# EAGLE design solar-counter-v1.0 (EAGLE 6.2)

## Sheet 1 of 2
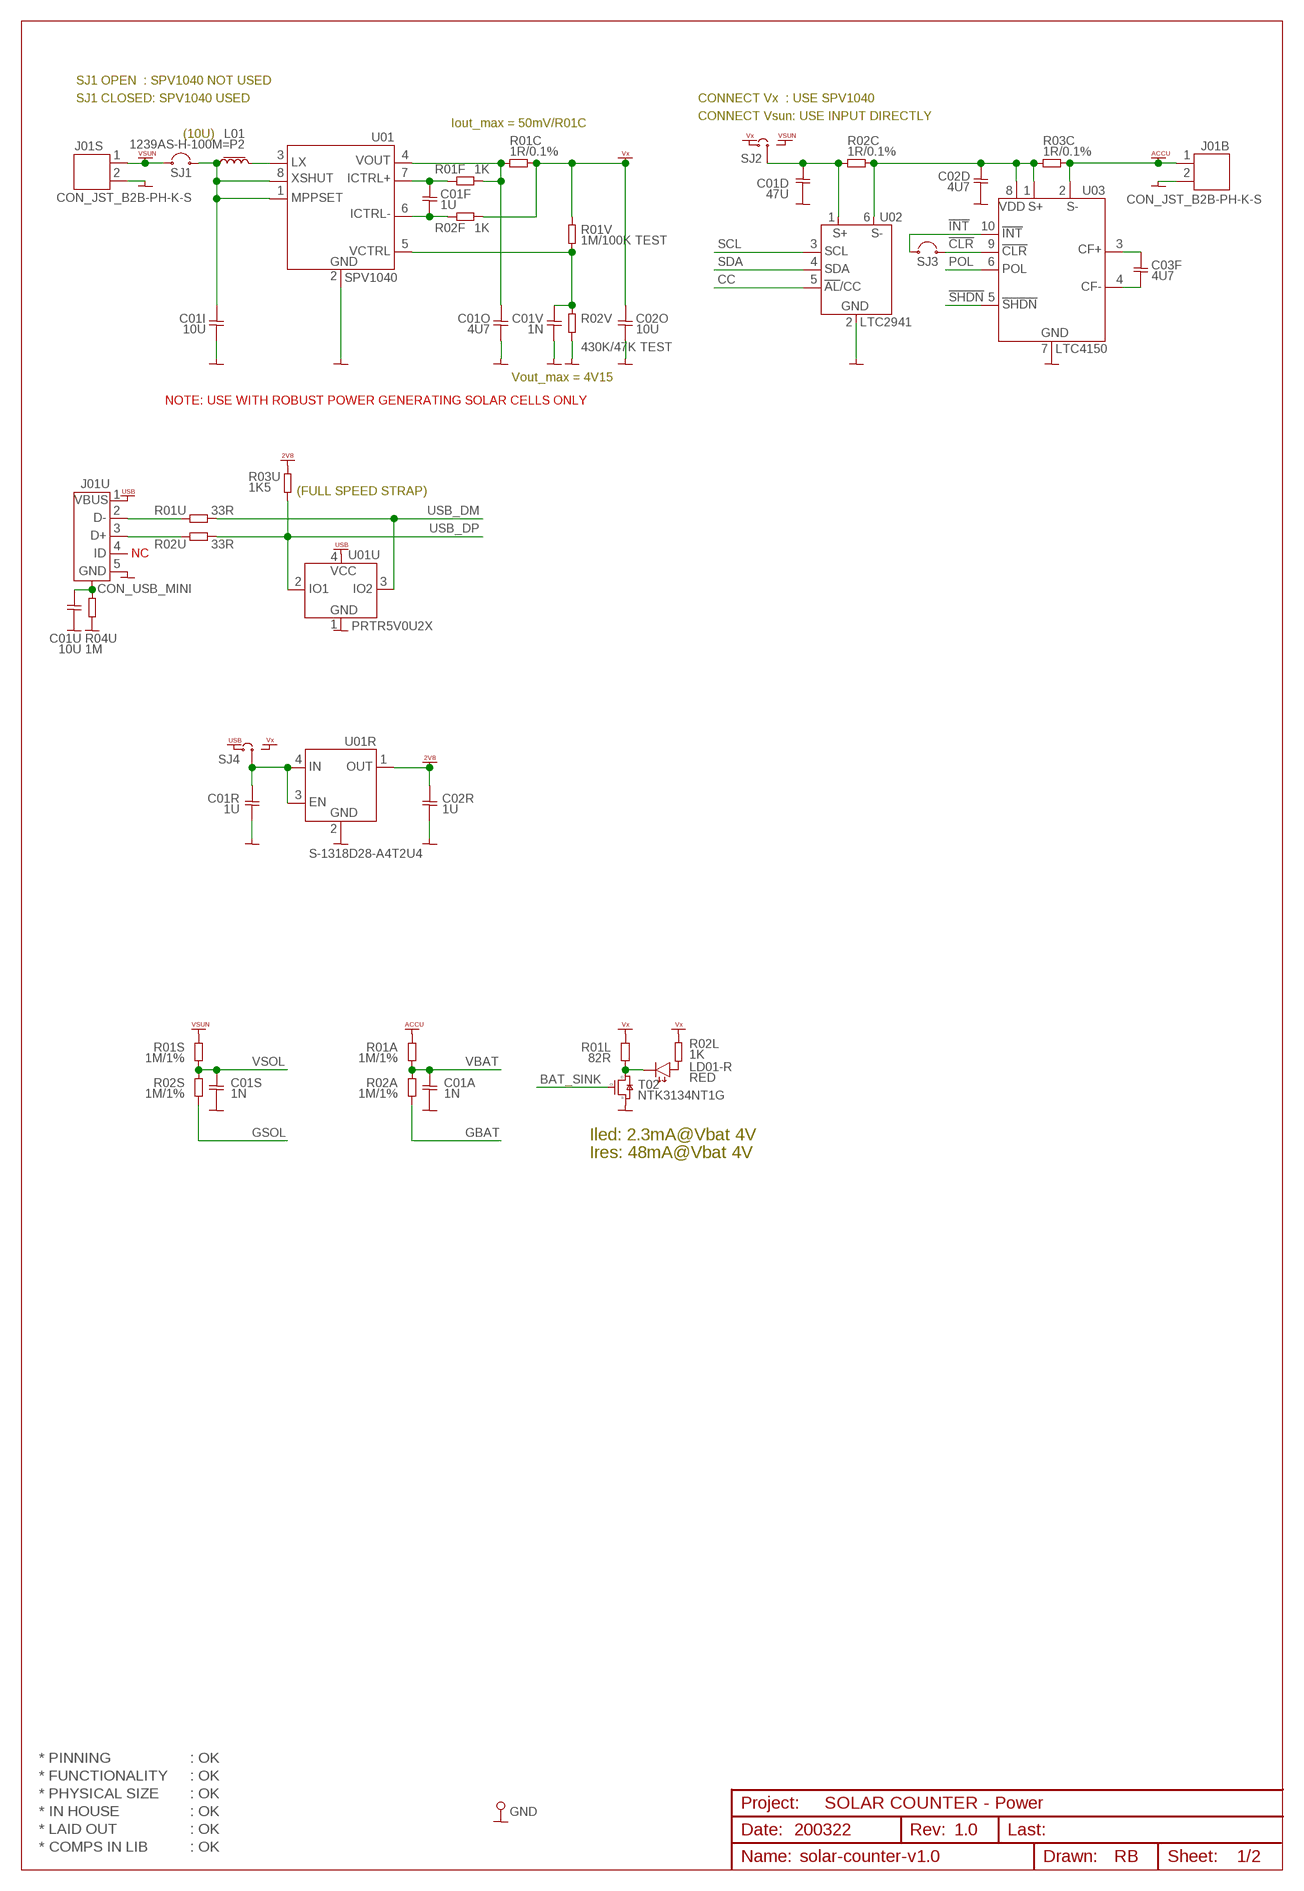
[diagram p0: schematic, sheet 1]

### Parts
C01A  1N  CAP0402  [CAP0402]
C01D  47U  CAP0603  [CAP0603]
C01F  1U  CAP0402  [CAP0402]
C01I  10U  CAP0603  [CAP0603]
C01O  4U7  CAP0402  [CAP0402]
C01R  1U  CAP0402  [CAP0402]
C01S  1N  CAP0402  [CAP0402]
C01U  10U  CAP0603  [CAP0603]
C01V  1N  CAP0402  [CAP0402]
C02D  4U7  CAP0402  [CAP0402]
C02O  10U  CAP0402  [CAP0402]
C02R  1U  CAP0402  [CAP0402]
C03F  4U7  CAP0402  [CAP0402]
GND  PIN_TEST  [HOLE_PTH_0.8MM]
J01B  CON_JST_B2B-PH-K-S  [CON_JST_B2B-PH-K-S]
J01S  CON_JST_B2B-PH-K-S  [CON_JST_B2B-PH-K-S]
J01U  CON_USB_MINI  [CON_USB-B_MINI]
L01  1239AS-H-100M=P2  L_1008  [L_1008]
LD01-R  RED  LED_SMD_0402  [LED_SMD_0402]
R01A  1M/1%  RES0402  [RES0402]
R01C  1R/0.1%  RES0402  [RES0402]
R01F  1K  RES0402  [RES0402]
R01L  82R  RES0402  [RES0402]
R01S  1M/1%  RES0402  [RES0402]
R01U  33R  RES0402  [RES0402]
R01V  1M/100K TEST  RES0402  [RES0402]
R02A  1M/1%  RES0402  [RES0402]
R02C  1R/0.1%  RES0402  [RES0402]
R02F  1K  RES0402  [RES0402]
R02L  1K  RES0402  [RES0402]
R02S  1M/1%  RES0402  [RES0402]
R02U  33R  RES0402  [RES0402]
R02V  430K/47K TEST  RES0402  [RES0402]
R03C  1R/0.1%  RES0402  [RES0402]
R03U  1K5  RES0402  [RES0402]
R04U  1M  RES0603  [RES0603]
SJ1  SJ2SJ2-S  [SJ2-S]
SJ2  SJ3SJ3-S  [SJ3-S]
SJ3  SJ2SJ2-S  [SJ2-S]
SJ4  SJ3SJ3-S  [SJ3-S]
T02  NTK3134NT1G  NFET_SOT723  [NFET_SOT723]
U01  SPV1040  [TSSOP8]
U01R  S-1318D28-A4T2U4  [HSNT-4-B]
U01U  PRTR5V0U2X  [SOT143B]
U02  LTC2941  [DFN6_2X3MM_NO-EXPOSED]
U03  LTC4150  [MSOP10]

### Nets
!CLR: SJ3.2 U03.9(9.!CLR) ; also sheet 2
!INT: SJ3.1 U03.10(10.!INT) ; also sheet 2
!SHDN: U03.5(5.!SHDN) ; also sheet 2
ACCU: J01B.1 R01A.2 R03C.2 U03.2(2.SENSE-) ; supply symbol labelled VACCU
BAT_SINK: T02.1(1.G) ; also sheet 2
CC: U02.5(5.AL/CC) ; also sheet 2
GBAT: R02A.1 ; also sheet 2
GND: C01A.2 C01D.2 C01I.2 C01O.2 C01R.2 C01S.2 C01U.2 C01V.2 C02D.2 C02O.2 C02R.2 GND.1 J01B.2 J01S.2 J01U.5(5.GND) R02V.2 R04U.2 T02.2(2.S) U01.2(2.GND) U01R.2(2.GND) U01R.5(2.GND) U01U.1(1.GND) U02.2(2.GND) U03.7(7.GND) ; also sheet 2
GSOL: R02S.1 ; also sheet 2
N$1: C01D.1 R02C.1 SJ2.2 U02.1(1.SENSE+)
N$2: LD01-R.A R02L.2
N$3: C01F.2 R02F.2 U01.6(6.ICTRL-)
N$4: C02D.1 R02C.2 R03C.1 U02.6(6.SENSE-) U03.1(1.SENSE+) U03.8(8.VDD)
N$6: C01I.1 L01.2 SJ1.2 U01.1(1.MPPSET) U01.8(8.XSHUT)
N$8: LD01-R.C R01L.1 T02.3(3.D)
N$9: C01F.1 R01F.2 U01.7(7.ICTRL+)
N$10: L01.1 U01.3(3.LX)
N$12: C03F.2 U03.4(4.CF-)
N$13: C03F.1 U03.3(3.CF+)
N$16: J01U.2(2.D-) R01U.1
N$18: J01U.3(3.D+) R02U.1
POL: U03.6(6.POL) ; also sheet 2
SCL: U02.3(3.SCL) ; also sheet 2
SDA: U02.4(4.SDA) ; also sheet 2
USB_CHASSIS: C01U.1 J01U.CASE1(CASE) J01U.CASE2(CASE) J01U.CASE3(CASE) J01U.CASE4(CASE) R04U.1
USB_DM: R01U.2 U01U.3(3.IO2) ; also sheet 2
USB_DP: R02U.2 R03U.1 U01U.2(2.IO1) ; also sheet 2
VBAT: C01A.1 R01A.1 R02A.2 ; also sheet 2
VDD_2V8: C02R.1 R03U.2 U01R.1(1.OUT) ; supply symbol labelled VCC_2V8 ; also sheet 2
VDD_USB: J01U.1(1.VBUS) SJ4.1 U01U.4(4.VCC) ; supply symbol labelled VCC_POWER-USB
VIN: C01R.1 SJ4.2 U01R.3(3.EN) U01R.4(4.IN)
VOUT: C01O.1 R01C.1 R01F.1 U01.4(4.VOUT)
VOUT_SET: C01V.1 R01V.2 R02V.1 U01.5(5.VCTRL)
VSOL: C01S.1 R01S.1 R02S.2 ; also sheet 2
VSUN: J01S.1 R01S.2 SJ1.1 SJ2.3
VX: C02O.1 R01C.2 R01L.2 R01V.1 R02F.1 R02L.1 SJ2.1 SJ4.3
Unconnected: J01U.4(4.ID)

### Notes on the sheet
- SJ1 OPEN  : SPV1040 NOT USED
- SJ1 CLOSED: SPV1040 USED | CONNECT Vx  : USE SPV1040
- CONNECT Vsun: USE INPUT DIRECTLY
- Iout_max = 50mV/R01C
- (10U)
- Vout_max = 4V15
- NOTE: USE WITH ROBUST POWER GENERATING SOLAR CELLS ONLY
- (FULL SPEED STRAP)
- NC
- Iled: 2.3mA@Vbat 4V
- Ires: 48mA@Vbat 4V
- * PINNING | : OK
- * FUNCTIONALITY | : OK
- * PHYSICAL SIZE | : OK
- SOLAR COUNTER - Power
- * IN HOUSE | : OK
- * LAID OUT | : OK | 200322 | 1.0
- * COMPS IN LIB | : OK

## Sheet 2 of 2
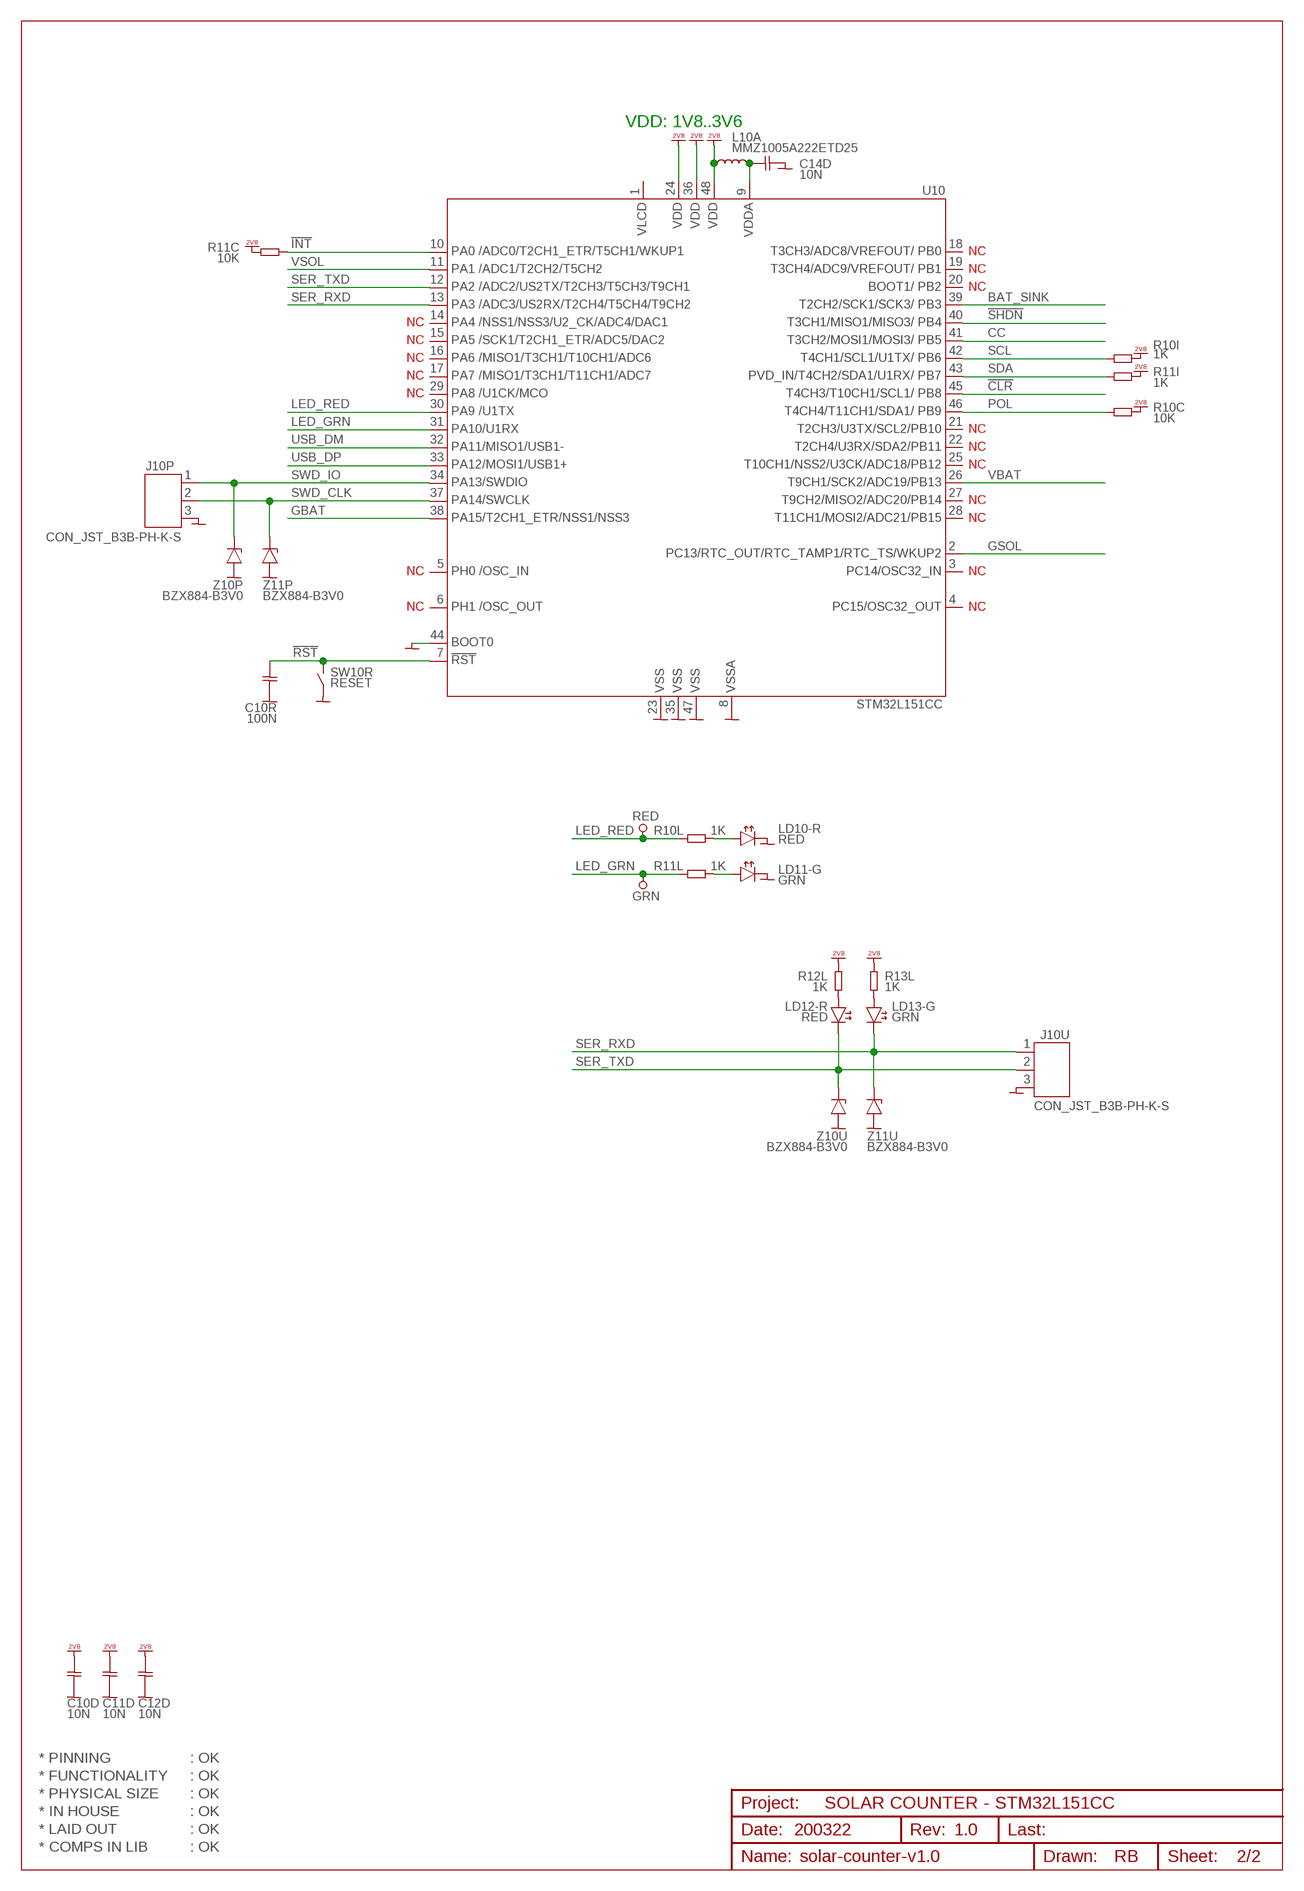
[diagram p1: schematic, sheet 2]

### Parts
C10D  10N  CAP0402  [CAP0402]
C10R  100N  CAP0402  [CAP0402]
C11D  10N  CAP0402  [CAP0402]
C12D  10N  CAP0402  [CAP0402]
C14D  10N  CAP0402  [CAP0402]
GRN  PIN_TEST_0.6MM  [HOLE_PTH_0.6MM]
J10P  CON_JST_B3B-PH-K-S  [CON_JST_B3B-PH-K-S]
J10U  CON_JST_B3B-PH-K-S  [CON_JST_B3B-PH-K-S]
L10A  MMZ1005A222ETD25  L_0402  [L_0402]
LD10-R  RED  LED_SMD_0402  [LED_SMD_0402]
LD11-G  GRN  LED_SMD_0402  [LED_SMD_0402]
LD12-R  RED  LED_SMD_0402  [LED_SMD_0402]
LD13-G  GRN  LED_SMD_0402  [LED_SMD_0402]
R10C  10K  RES0402  [RES0402]
R10I  1K  RES0402  [RES0402]
R10L  1K  RES0402  [RES0402]
R11C  10K  RES0402  [RES0402]
R11I  1K  RES0402  [RES0402]
R11L  1K  RES0402  [RES0402]
R12L  1K  RES0402  [RES0402]
R13L  1K  RES0402  [RES0402]
RED  PIN_TEST_0.6MM  [HOLE_PTH_0.6MM]
SW10R  RESET  SWITCH_PUSHBUTTON  [SWITCH_SMD_PBUTTON_2P]
U10  STM32L151CC  [LQFP48]
Z10P  BZX884-B3V0  ZENER_SOD923  [ZENER_SOD923]
Z10U  BZX884-B3V0  ZENER_SOD923  [ZENER_SOD923]
Z11P  BZX884-B3V0  ZENER_SOD923  [ZENER_SOD923]
Z11U  BZX884-B3V0  ZENER_SOD923  [ZENER_SOD923]

### Nets
!CLR: U10.45(45.PB8) ; also sheet 1
!INT: R11C.1 U10.10(10.PA0) ; also sheet 1
!RST: C10R.1 SW10R.1(1-2) U10.7(7.!RST)
!SHDN: U10.40(40.PB4) ; also sheet 1
BAT_SINK: U10.39(39.PB3) ; also sheet 1
CC: U10.41(41.PB5) ; also sheet 1
GBAT: U10.38(38.PA15) ; also sheet 1
GND: C10D.2 C10R.2 C11D.2 C12D.2 C14D.2 J10P.3 J10U.3 LD10-R.C LD11-G.C SW10R.2(3-4) U10.8(8.GND) U10.23(23.GND) U10.35(35.GND) U10.44(44.BOOT0) U10.47(47.GND) Z10P.2(A) Z10U.2(A) Z11P.2(A) Z11U.2(A) ; also sheet 1
GSOL: U10.2(2.PC13) ; also sheet 1
LED_GRN: GRN.1 R11L.1 U10.31(31.PA10)
LED_RED: R10L.1 RED.1 U10.30(30.PA9)
N$5: LD13-G.A R13L.2
N$7: LD12-R.A R12L.2
N$38: LD11-G.A R11L.2
N$39: LD10-R.A R10L.2
POL: R10C.1 U10.46(46.PB9) ; also sheet 1
SCL: R10I.1 U10.42(42.PB6) ; also sheet 1
SDA: R11I.1 U10.43(43.PB7) ; also sheet 1
SER_RXD: J10U.1 LD13-G.C U10.13(13.PA3) Z11U.1(C)
SER_TXD: J10U.2 LD12-R.C U10.12(12.PA2) Z10U.1(C)
SWD_CLK: J10P.2 U10.37(37.PA14) Z11P.1(C)
SWD_IO: J10P.1 U10.34(34.PA13) Z10P.1(C)
USB_DM: U10.32(32.PA11) ; also sheet 1
USB_DP: U10.33(33.PA12) ; also sheet 1
VBAT: U10.26(26.PB13) ; also sheet 1
VDD_2V8: C10D.1 C11D.1 C12D.1 L10A.1 R10C.2 R10I.2 R11C.2 R11I.2 R12L.1 R13L.1 U10.24(24.VDD) U10.36(36.VDD) U10.48(48.VDD) ; supply symbol labelled VCC_2V8 ; also sheet 1
VDDA: C14D.1 L10A.2 U10.9(9.VDD)
VSOL: U10.11(11.PA1) ; also sheet 1
Unconnected: U10.1(1.VDD) U10.3(3.PC14) U10.4(4.PC15) U10.5(5.OSC_IN) U10.6(6.OSC_OUT) U10.14(14.PA4) U10.15(15.PA5) U10.16(16.PA6) U10.17(17.PA7) U10.18(18.PB0) U10.19(19.PB1) U10.20(20.PB2) U10.21(21.PB10) U10.22(22.PB11) U10.25(25.PB12) U10.27(27.PB14) U10.28(28.PB15) U10.29(29.PA8)

### Notes on the sheet
- VDD: 1V8..3V6
- NC
- NC
- NC
- NC
- NC
- NC
- NC
- NC
- NC
- NC
- NC
- NC
- NC
- NC | NC
- NC | NC
- * PINNING | : OK
- * FUNCTIONALITY | : OK
- * PHYSICAL SIZE | : OK
- SOLAR COUNTER - STM32L151CC
- * IN HOUSE | : OK
- * LAID OUT | : OK | 200322 | 1.0
- * COMPS IN LIB | : OK

## Library data of the parts
C01A C01F C01O C01R C01S C01V C02D C02O C02R C03F C10D C10R C11D C12D C14D = 00-own_parts:CAP0402: Capacitor, ceramic, 0402
C01D C01I C01U = 00-own_parts:CAP0603: Capacitor, ceramic, 0603
GND = 00-own_parts:PIN_TEST: Pin, test pad, hole 0.8mm, pad 1.6mm
GRN RED = 00-own_parts:PIN_TEST_0.6MM: Pin, test pad, hole 0.6mm, pad 1.0mm
J01B J01S = 00-own_parts:CON_JST_B2B-PH-K-S: Connector, JST, 2.0mm pitch, 2p, top entry
J01U = 00-own_parts:CON_USB_MINI: Connector, USB B mini, 2.0 OTG, SMT, F#231-3554
J10P J10U = 00-own_parts:CON_JST_B3B-PH-K-S: Connector, JST, 2.0mm pitch, 3p, top entry
L01 = 00-own_parts:L_1008: Inductor, 1008 (2520 metric), chip ferrite bead/wirewound
L10A = 00-own_parts:L_0402: Inductor, 0402
LD01-R LD10-R LD11-G LD12-R LD13-G = 00-own_parts:LED_SMD_0402: LED, SMD, 0402 (PICOLED)
R01A R01C R01F R01L R01S R01U R01V R02A R02C R02F R02L R02S R02U R02V R03C R03U R04U R10C R10I R10L R11C R11I R11L R12L R13L = 00-own_parts:RES
SJ1 SJ3 = 00-own_parts:SJ2: Solder jumper, SMD, 2 way
SJ2 SJ4 = 00-own_parts:SJ3: Solder jumper, SMD, 3 way
SW10R = 00-own_parts:SWITCH_PUSHBUTTON: Switch, push button, SPNO, MCTAEF, F# 160-5485
T02 = 00-own_parts:NFET_SOT723: n-FET, generic SOT723
U01 = 00-own_parts:SPV1040: DC/DC converter, solar battery charger with embedded MPPT, TSSOP8
U01R = 00-own_parts:S-1318D28-A4T2U4: Regulator, LDO w. enable, Vin=1V7..5V5, Vout=2V8, Vdrop=45mV, Iout=100mA, Iss=95nA, HSNT-4-8
U01U = 00-own_parts:PRTR5V0U2X: Zener, ESD protection, USB data + power, SOT143B, DK#568-4140-2-ND
U02 = 00-own_parts:LTC2941: Current sense amplifier, battery gas gauge, I2C, DFN6
U03 = 00-own_parts:LTC4150: Current sense amplifier, battery gas gauge, MSOP10
U10 = 00-own_parts:STM32L151CC: MCU, ultra-low power, ARM Cortex M3, 32-bit, 32 MHz, 256 kB Flash, 32 kB SRAM, 8 kB EEPROM, USB, ADC, DAC, LQFP48
Z10P Z10U Z11P Z11U = 00-own_parts:ZENER_SOD923: Zener, generic SOD923

## Board
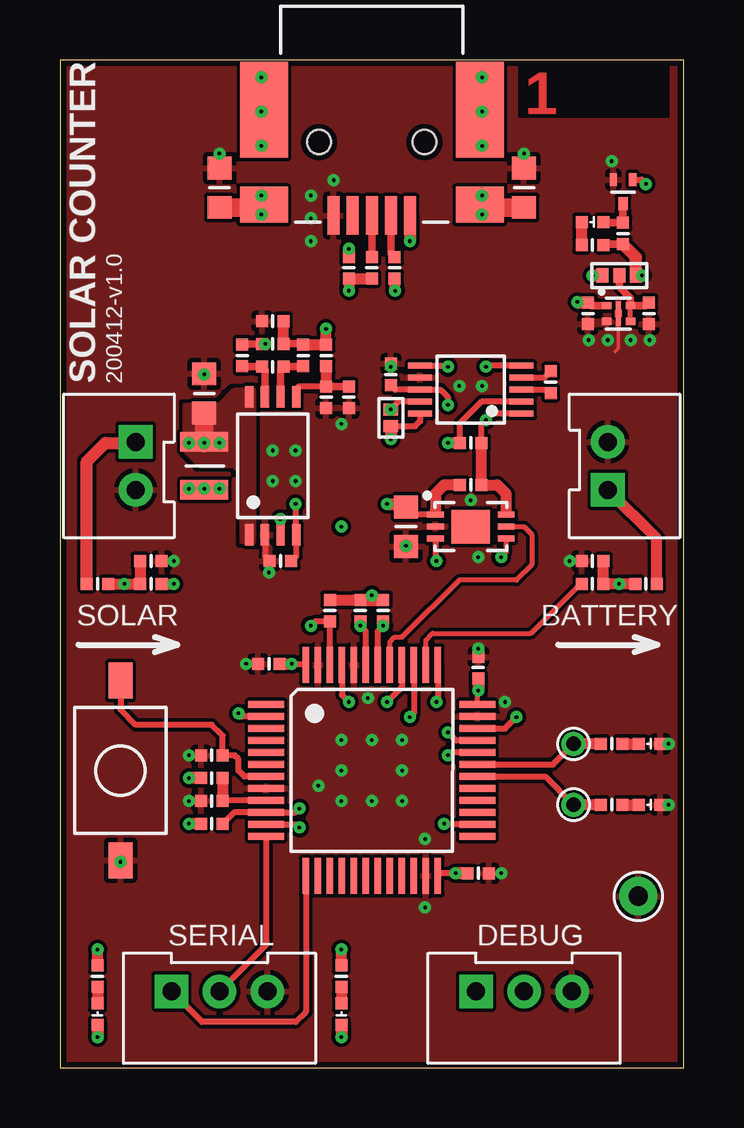
[diagram p2: board, top side]
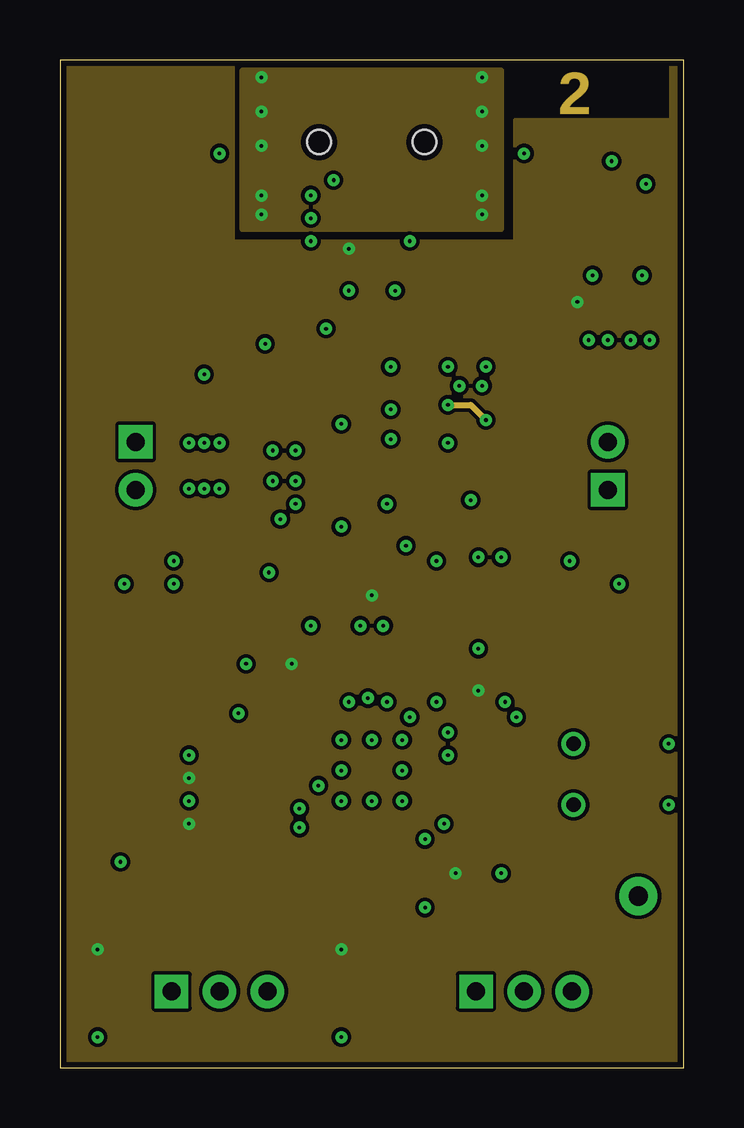
[diagram p3: board, inner layer Route2]
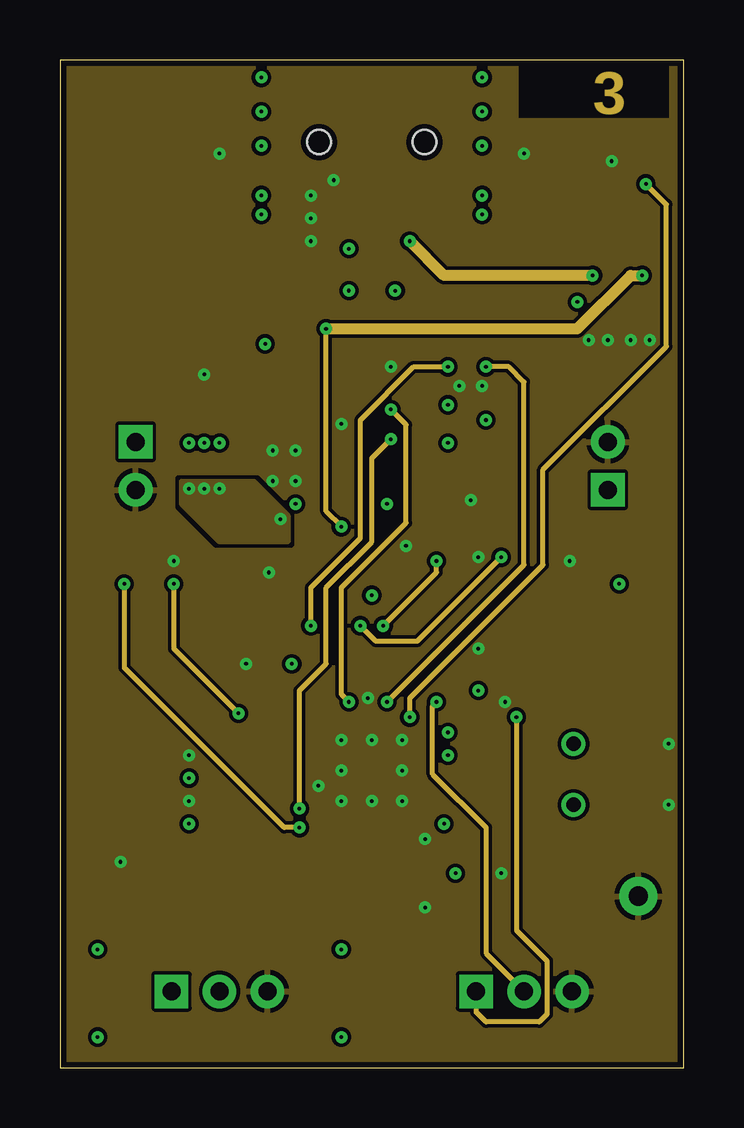
[diagram p4: board, inner layer Route15]
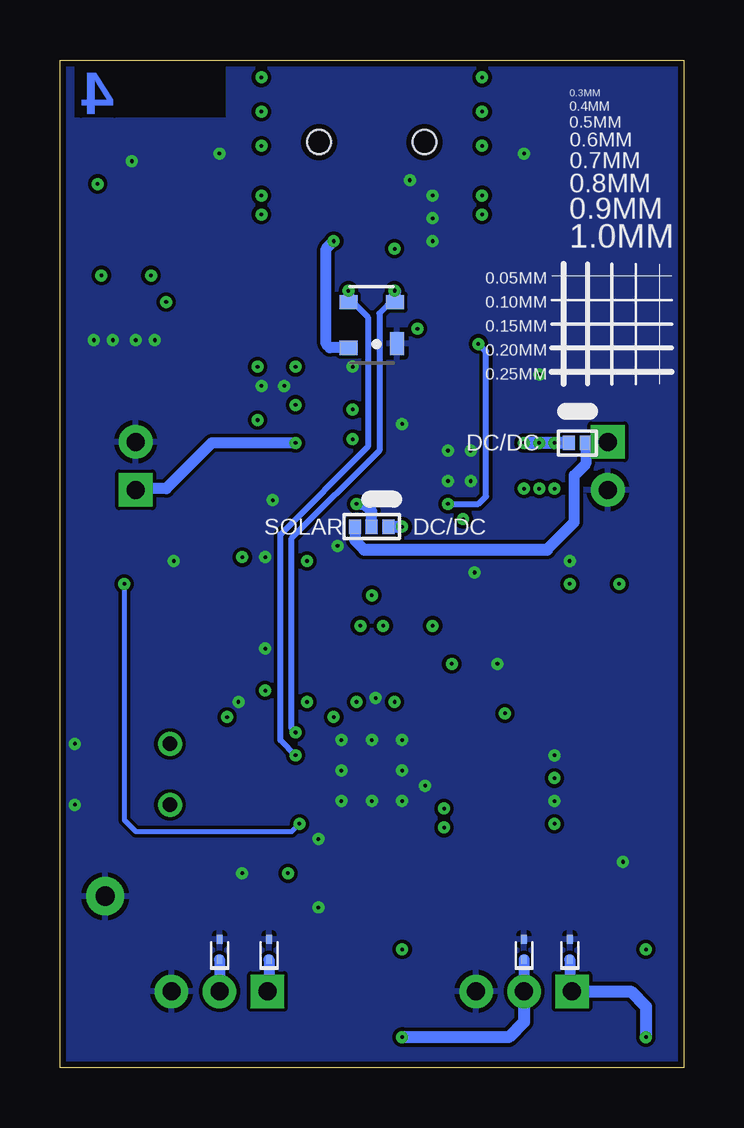
[diagram p5: board, bottom side, seen from below]

Size 26 x 42 mm. Coordinates in mm from the lower left corner, seen from the top.
Outline: 26,0 26,42 0,42 0,0 26,0
Copper layers (1*2*15*16): Top 0.018mm / dielectric 0.36mm / Route2 0.035mm / dielectric 0.71mm / Route15 0.035mm / dielectric 0.36mm / Bottom 0.018mm
Design rules: minimum track width 0.15mm, minimum drill 0.15mm, track to track 0.15mm, track to pad 0.15mm, pad to pad 0.15mm, via to via 0.15mm, smd to smd 0mil, copper to edge 0.25mm, drill to drill 0.3mm, minimum pad ring 0.2mm, minimum via ring 0.125mm, stop-mask expansion 0.1mm, vias tented up to drill 0.15mm, thermal gap 0.2mm

### Footprints (pad centres in the part's own frame; a part is rotated, then mirrored left to right if it is on the bottom)
CAP0402 = smd 0.5 x 0.5: 1 -0.45,0; 2 0.45,0
CAP0603 = smd 0.95 x 1: 1 -0.821,0.002; 2 0.822,0
HOLE_PTH_0.8MM = drill 0.8 pad 1.6: 1 0,0
HOLE_PTH_0.6MM = drill 0.6 pad 1: 1 0,0
CON_JST_B2B-PH-K-S = drill 0.75 pad 1.4 square: 1 -1,0 | drill 0.75 pad 1.4: 2 1,0
CON_USB-B_MINI = smd 0.5 x 1.6: 1 -1.6,2.9; 2 -0.8,2.9; 3 0,2.9; 4 0.8,2.9; 5 1.6,2.9 | smd 2 x 1.5: CASE1 4.5,2.45; CASE4 -4.5,2.45 | smd 2 x 4: CASE2 4.5,-1.5; CASE3 -4.5,-1.5 | hole 1: 2.2,-0.16; -2.2,-0.16
CON_JST_B3B-PH-K-S = drill 0.75 pad 1.4 square: 1 -2,0 | drill 0.75 pad 1.4: 2 0,0; 3 2,0
L_1008 = smd 0.8 x 2: 1 -1,0; 2 1,0
L_0402 = smd 0.5 x 0.5: 1 -0.45,0; 2 0.45,0
LED_SMD_0402 = smd 0.5 x 0.5: A -0.45,0; C 0.45,0.001
RES0402 = smd 0.5 x 0.5: 1 -0.45,0; 2 0.45,0
RES0603 = smd 0.95 x 1: 1 -0.821,0.002; 2 0.822,0
SJ2-S = smd 0.5 x 0.6: 1 -0.35,0; 2 0.35,0
SJ3-S = smd 0.5 x 0.6: 1 -0.7,0; 2 0.004,0; 3 0.7,0
SWITCH_SMD_PBUTTON_2P = smd 1.5 x 1: 1 -3.75,0; 2 3.75,0
NFET_SOT723 = smd 0.3 x 0.55: 1 -0.4,-0.5; 2 0.4,-0.5 | smd 0.4 x 0.55: 3 0,0.5
TSSOP8 = smd 0.9 x 0.35: 1 -2.875,0.975; 2 -2.875,0.325; 3 -2.875,-0.325; 4 -2.875,-0.975; 5 2.875,-0.975; 6 2.875,-0.325; 7 2.875,0.325; 8 2.875,0.975
HSNT-4-B = smd 0.3 x 0.4: 1 -0.325,-0.5; 2 0.325,-0.5; 3 0.325,0.5; 4 -0.325,0.5 | smd 1 x 0.2: 5 0,0
SOT143B = smd 0.95 x 0.6: 1 -0.775,-1.05 | smd 0.6 x 0.75: 2 0.95,-0.975; 3 0.95,0.975; 4 -0.95,0.975
DFN6_2X3MM_NO-EXPOSED = smd 0.25 x 0.7: 1 -0.5,-1.475; 2 0,-1.475; 3 0.5,-1.475; 4 0.5,1.475; 5 0,1.475; 6 -0.5,1.475 | smd 1.4 x 1.6: TP 0,0
MSOP10 = smd 0.25 x 1: 1 -1,-2.113; 2 -0.5,-2.113; 3 0,-2.113; 4 0.5,-2.113; 5 1,-2.113; 6 1,2.113; 7 0.5,2.113; 8 0,2.113; 9 -0.5,2.113; 10 -1,2.113
LQFP48 = smd 0.28 x 1.5: 1 -2.75,-4.4; 2 -2.25,-4.4; 3 -1.75,-4.4; 4 -1.25,-4.4; 5 -0.75,-4.4; 6 -0.25,-4.4; 7 0.25,-4.4; 8 0.75,-4.4; 9 1.25,-4.4; 10 1.75,-4.4; 11 2.25,-4.4; 12 2.75,-4.4; 25 2.75,4.4; 26 2.25,4.4; 27 1.75,4.4; 28 1.25,4.4; 29 0.75,4.4; 30 0.25,4.4; 31 -0.25,4.4; 32 -0.75,4.4; 33 -1.25,4.4; 34 -1.75,4.4; 35 -2.25,4.4; 36 -2.75,4.4 | smd 1.5 x 0.28: 13 4.4,-2.75; 14 4.4,-2.25; 15 4.4,-1.75; 16 4.4,-1.25; 17 4.4,-0.75; 18 4.4,-0.25; 19 4.4,0.25; 20 4.4,0.75; 21 4.4,1.25; 22 4.4,1.75; 23 4.4,2.25; 24 4.4,2.75; 37 -4.4,2.75; 38 -4.4,2.25; 39 -4.4,1.75; 40 -4.4,1.25; 41 -4.4,0.75; 42 -4.4,0.25; 43 -4.4,-0.25; 44 -4.4,-0.75; 45 -4.4,-1.25; 46 -4.4,-1.75; 47 -4.4,-2.25; 48 -4.4,-2.75
ZENER_SOD923 = smd 0.36 x 0.25: 1 -0.42,0; 2 0.42,0

### Placement (x,y rotation side)
C01A  22.21,21.11 180 top
C01D  14.43,22.54 270 top
C01F  8.87,29.21 0 top
C01I  6.01,28.1 90 top
C01O  9.19,21.11 180 top
C01R  24.56,31.43 270 top
C01S  3.79,21.11 0 top
C01U  6.65,36.67 90 top
C01V  12.05,27.94 270 top
C02D  13.79,28.89 90 top
C02O  8.87,31.11 180 top
C02R  22.02,31.43 270 top
C03F  20.46,28.57 90 top
C10D  17.45,8.1 0 top
C10R  6.33,13.02 180 top
C11D  17.45,16.67 90 top
C12D  8.71,16.83 180 top
C14D  6.33,11.11 180 top
GND  24.11,7.14 0 top
GRN  21.41,13.49 180 top
J01B  22.84,25.08 90 top
J01S  3.16,25.08 270 top
J01U  13,38.42 180 top
J10P  19.35,3.17 0 top
J10U  6.65,3.17 0 top
L01  6.01,25.08 90 top
L10A  6.33,12.06 0 top
LD01-R  22.21,35.24 0 top
LD10-R  24.59,10.95 0 top
LD11-G  24.59,13.49 0 top
LD12-R  11.73,2.22 270 top
LD13-G  1.57,2.22 270 top
R01A  24.43,20.16 0 top
R01C  8.87,30.16 0 top
R01F  7.6,29.69 270 top
R01L  23.48,34.77 270 top
R01S  1.57,20.16 180 top
R01U  13.95,33.34 270 top
R01V  11.1,29.69 270 top
R02A  22.21,20.16 0 top
R02C  17.13,24.29 0 top
R02F  10.14,29.69 270 top
R02L  22.21,34.29 180 top
R02S  3.79,20.16 180 top
R02U  13,33.34 270 top
R02V  11.1,27.94 270 top
R03C  17.13,26.04 180 top
R03U  12.05,33.34 90 top
R04U  19.35,36.67 90 top
R10C  11.25,19.05 90 top
R10I  13.48,19.05 90 top
R10L  23,10.95 0 top
R11C  6.33,10.16 180 top
R11I  12.52,19.05 90 top
R11L  23,13.49 0 top
R12L  11.73,3.81 270 top
R13L  1.57,3.81 270 top
RED  21.41,10.95 180 top
SJ1  4.43,26.04 180 bottom
SJ2  13,22.54 180 bottom
SJ3  13.79,27.08 90 top
SJ4  23.32,33.02 0 top
SW10R  2.52,12.38 270 top
T02  23.48,36.51 180 top
U01  8.87,25.08 90 top
U01R  23.29,31.43 270 top
U01U  13,30.96 90 bottom
U02  17.13,22.54 270 top
U03  17.13,28.26 90 top
U10  13,12.38 270 top
Z10P  17.29,4.92 90 bottom
Z10U  6.65,4.92 90 bottom
Z11P  19.35,4.92 90 bottom
Z11U  4.74,4.92 90 bottom

### Tracks (layer width: path | path; a pad name or v marks a point on that pad's centre or on a via)
!CLR  (via drill 0.15 pad 0.5)
  Top 0.254: U10.45 11.75,15.54 v12.05,15.24 | U03.9 14.12,27.76 SJ3.2
  Route15 0.203: SJ3.2 14.43,26.8 14.43,22.7 11.73,20 11.73,15.56 v12.05,15.24
  other vias: 13.79,27.43
!INT  (via drill 0.15 pad 0.5)
  Top 0.254: v9.98,10.79 9.82,10.63 U10.10 7.25,10.63 R11C.1 | SJ3.1 14.81,26.73 15.01,26.94 U03.10
  Top 0.508: SJ3.1 v13.79,26.19
  Route15 0.203: v9.98,10.79 9.98,15.72 11.1,16.83 11.1,20 13,21.91 13,25.4 v13.79,26.19
!RST
  Top 0.254: U10.7 7.69,12.13 7.44,12.38 7.44,12.86 7.29,13.02 C10R.1 6.78,13.84 6.33,14.29 3.16,14.29 2.52,14.92 SW10R.1
!SHDN  (via drill 0.15 pad 0.5)
  Top 0.254: U10.40 14.25,15.86 v13.63,15.24 | U03.5 17.81,29.26 v17.76,29.21
  Route15 0.203: v13.63,15.24 19.35,20.95 19.35,28.57 18.71,29.21 v17.76,29.21
ACCU  (via drill 0.15 pad 0.5)
  Top 0.254: U03.2 17.58,27.76 16.68,26.86 R03C.2
  Top 0.457: R01A.2 24.88,22.05 J01B.1 | R03C.2 v16.18,26.04
  Bottom 0.457: v16.18,26.04 19.67,26.04 21.57,24.13 22.8,24.13 J01B.1
BAT_SINK  (via drill 0.15 pad 0.5)
  Top 0.254: U10.39 14.75,14.77 v14.59,14.61 | T02.1 24.25,37.01 v24.43,36.83
  Route15 0.203: v14.59,14.61 14.59,15.4 20.14,20.95 20.14,24.92 25.28,30.06 25.28,35.98 v24.43,36.83
CC
  Top 0.203: U02.5 19.35,22.54 19.67,22.23 19.67,20.95 19.03,20.32 16.65,20.32 14.27,17.94 13.95,17.94 13.75,17.74 U10.41
GBAT
  Top 0.203: U10.38 15.25,17.81 15.54,18.1 19.64,18.1 21.71,20.16 R02A.1
GND  (via drill 0.15 pad 0.5)
  Top 0.152: U01R.5 23.29,29.97 23.16,29.84
  Top 0.254: U01.2 8.55,21.31 C01O.2
  other vias: 11.73,13.65 14.27,13.65 14.27,11.11 11.73,11.11 13,13.65 11.73,12.38 14.27,12.38 13,11.11 6.65,38.1 19.35,38.1 8.87,25.72 8.87,24.45 9.82,24.45 9.82,25.72 14.43,21.75 17.6,28.42 16.65,28.42 13.79,29.21 11.73,26.83 6.01,28.89 4.74,21.11 21.26,21.11 17.45,17.46 7.76,16.83 18.4,8.1 2.52,8.57 5.38,11.11 5.38,13.02 8.71,20.64 22.05,30.32 24.59,30.32 22.84,30.32 23.8,30.32 23,37.78 10.46,35.4 10.46,36.35 10.46,34.45 11.41,36.99 15.22,9.53 15.22,6.67 10.78,11.75 18.56,15.24 12.84,15.4 17.13,23.65 17.45,21.27 25.38,13.49 25.38,10.95
  pour Top (rank 6): 26,-0.25 0,-0.25 0.05,42 19,42 19,39.5 25.5,39.5 25.5,42 26,42
  pour Bottom (rank 6): 26,-0.25 0,-0.25 0,42 19,42 19,39.5 25.5,39.5 25.5,42 26,42
  pour Route15 (rank 2): 26,-0.25 0,-0.25 0,42 19,42 19,39.5 25.5,39.5 25.5,42 26,42
GSOL  (via drill 0.15 pad 0.5)
  Top 0.254: U10.2 7.58,14.63 v7.44,14.76
  Top 0.457: R02S.1 v4.74,20.16
  Route15 0.203: v4.74,20.16 4.74,17.46 v7.44,14.76
LED_GRN
  Top 0.254: U10.31 20.55,12.63 GRN.1
  Top 0.457: R11L.1 GRN.1
LED_RED
  Top 0.254: U10.30 20.23,12.13 RED.1
  Top 0.457: R10L.1 RED.1
N$1  (via drill 0.15 pad 0.5)
  Top 0.254: 14.75,23.04 U02.1 15.65,23.22
  Top 0.305: 14.75,23.04 C01D.1
  Top 0.457: R02C.1 16.02,24.29 15.65,23.93 15.65,23.22
  Top 0.508: v13.63,23.5 14.3,23.5 C01D.1
  Bottom 0.457: SJ2.2 13,23.17 13,23.18 13.32,23.5 v13.63,23.5
N$2
  Top 0.457: R02L.2 LD01-R.A | LD01-R.A
N$3
  Top 0.305: R02F.2 10.14,29.21 C01F.2 9.2,29.09 U01.6
N$4  (via drill 0.15 pad 0.5)
  Top 0.254: C02D.1 13.98,28.26 U03.8 15.86,28.26 16.18,27.94 v16.18,27.62 | U02.6 18.6,23.22 | U03.1 18.03,27.26 v17.76,26.99 17.58,26.8 R03C.1
  Top 0.457: 18.6,23.22 18.6,23.93 18.24,24.29 R02C.2 R03C.1
  Route2 0.254: v16.18,27.62 17.13,27.62 v17.76,26.99
N$5
  Top 0.457: R13L.2 LD13-G.A
N$6  (via drill 0.15 pad 0.5)
  Top 0.762: v6.01,26.04 C01I.1
  Bottom 0.508: SJ1.2 v5.38,26.04 v6.01,26.04 v6.65,26.04
  pour Top (no thermals): 5.22,25.72 5.22,27.62 6.65,27.62 7.29,28.26 8.08,28.26 8.08,21.91 7.6,21.91 7.6,24.77 7.29,25.08 5.86,25.08
N$7
  Top 0.457: R12L.2 LD12-R.A
N$8
  Top 0.305: T02.3 R01L.1 22.68,35.22 LD01-R.C
N$9
  Top 0.305: R01F.2 7.6,29.21 C01F.1 8.55,29.09 U01.7
N$10  (via drill 0.15 pad 0.5)
  Top 0.203: L01.1 v6.01,24.13
  Top 0.254: U01.3 v9.2,22.85 v9.19,22.86
  other vias: 5.38,24.13 6.65,24.13
  pour Route15: 5.06,24.45 8.08,24.45 9.51,23.02 9.51,21.91 6.65,21.91 5.06,23.5
N$12
  Top 0.254: U03.4 20.19,28.76 C03F.2
N$13
  Top 0.254: U03.3 20.33,28.26 C03F.1
N$16
  Top 0.305: J01U.2 13.8,33.94 R01U.1
N$18
  Top 0.305: J01U.3 R02U.1
N$38
  Top 0.457: R11L.2 LD11-G.A
N$39
  Top 0.457: R10L.2 LD10-R.A
POL  (via drill 0.15 pad 0.5)
  Top 0.254: U03.6 16.13,29.26 v16.18,29.21 | R10C.1 11.1,18.6 | 11.1,18.6 10.64,18.6 v10.46,18.41 | U10.46 11.25,18.45 11.1,18.6
  Route15 0.203: v10.46,18.41 10.46,20 12.52,22.07 12.52,26.99 14.75,29.21 v16.18,29.21
SCL  (via drill 0.15 pad 0.5)
  Top 0.203: 13.5,18.39 v13.48,18.41 R10I.1
  Top 0.254: U02.3 15.65,21.16 v15.7,21.11 | U10.42 13.25,18.19 v13.48,18.41
  Route15 0.203: v13.48,18.41 15.7,20.64 v15.7,21.11
SDA  (via drill 0.15 pad 0.5)
  Top 0.203: U02.4 18.6,21.48 v18.4,21.27 | 12.5,18.55 12.5,18.44 v12.52,18.41
  Top 0.254: U10.43 12.75,18.19 v12.52,18.41 | 12.5,18.55 12.5,18.58 R11I.1
  Route15 0.203: v12.52,18.41 13.16,17.78 14.9,17.78 v18.4,21.27
SER_RXD  (via drill 0.15 pad 0.5)
  Top 0.254: U10.13 10.25,2.33 9.82,1.91 5.92,1.91 J10U.1
  Top 0.508: LD13-G.C v1.57,1.27
  Bottom 0.254: 4.74,3.27 J10U.1
  Bottom 0.457: Z11U.1 4.74,3.27
  Bottom 0.508: J10U.1 2.21,3.17 1.57,2.54 v1.57,1.27
SER_TXD  (via drill 0.15 pad 0.5)
  Top 0.254: U10.12 8.6,5.12 J10U.2
  Top 0.508: LD12-R.C v11.73,1.27
  Bottom 0.457: Z10U.1 J10U.2
  Bottom 0.508: J10U.2 6.65,1.91 7.29,1.27 v11.73,1.27
SWD_CLK  (via drill 0.15 pad 0.5)
  Top 0.254: U10.37 15.75,15.29 v15.7,15.24
  Route15 0.203: J10P.2 17.76,4.76 17.76,10 15.54,12.22 15.54,15.08 v15.7,15.24
  Bottom 0.457: Z11P.1 J10P.2
SWD_IO  (via drill 0.15 pad 0.5)
  Top 0.254: U10.34 18.56,14.13 v19.03,14.61
  Route15 0.203: v19.03,14.61 19.03,5.71 20.3,4.45 20.3,2.22 19.98,1.91 17.76,1.91 17.35,2.32 J10P.1
  Bottom 0.305: 17.29,3.24 J10P.1
  Bottom 0.457: Z10P.1 17.29,3.24
USB_CHASSIS  (via drill 0.15 pad 0.5)
  Top 0.254: v8.4,36.35 8.4,36.02 | v17.6,39.85 17.57,39.85 J01U.CASE3 | v8.4,39.85 8.43,39.85 J01U.CASE2
  Top 0.457: v17.6,35.56 17.6,35.86 J01U.CASE4 | J01U.CASE1 8.45,35.97 8.4,36.02
  Top 0.762: C01U.1 8.22,35.85 8.4,36.02 | R04U.1 17.62,35.85 J01U.CASE4
  other vias: 8.4,41.27 8.4,38.42 8.4,35.56 17.6,36.35 17.6,38.42 17.6,41.27
  pour Route2: 7.6,34.92 7.6,41.59 18.4,41.59 18.4,34.92
USB_DM  (via drill 0.15 pad 0.5)
  Top 0.254: 13.95,32.41 v13.97,32.38 | U10.32 16.29,13.13 v16.18,13.02
  Top 0.457: R01U.2 13.95,32.41
  Bottom 0.254: 13.95,32.06 13.16,31.27 13.16,25.88 16.81,22.23 16.81,13.65 v16.18,13.02
  Bottom 0.457: v13.97,32.38 13.95,32.36 13.95,32.06 13.97,32.04 U01U.3
USB_DP  (via drill 0.15 pad 0.5)
  Top 0.254: U10.33 16.51,13.63 v16.18,13.97
  Top 0.457: R02U.2 R03U.1 v12.05,32.38
  Bottom 0.254: 12.05,32.06 12.68,31.43 12.68,25.72 16.33,22.07 16.33,14.13 v16.18,13.97
  Bottom 0.457: v12.05,32.38
  Bottom 0.508: v12.05,32.38 12.03,32.36 U01U.2 12.03,32.04 12.05,32.06
VBAT  (via drill 0.15 pad 0.5)
  Top 0.254: U10.26 16.04,10.13 v16.02,10.16
  Top 0.457: R01A.1 v23.32,20.16 R02A.2 C01A.1
  Bottom 0.203: v23.32,20.16 23.32,10.32 22.84,9.84 16.33,9.84 v16.02,10.16
VDD_2V8  (via drill 0.15 pad 0.5)
  Top 0.203: U10.36 17.4,15.67 v17.45,15.72
  Top 0.254: v16.49,8.1 15.86,8.1 U10.24 | v9.67,16.83 10.21,16.83 U10.48
  Top 0.305: U01R.1 22.14,31.76 C02R.1
  Top 0.457: C12D.1 v9.67,16.83 | R13L.1 v1.57,4.92 | R12L.1 v11.73,4.92 | R10C.2 R11I.2 | R11C.2 v5.38,10.16
  Top 0.508: L10A.1 v5.38,12.06 | C11D.1 v17.45,15.72 | C10D.1 v16.49,8.1 | R03U.2 v12.05,34.13 | C02R.1 21.6,31.88 v21.57,31.91 | R11I.2 13,19.5 | 13,19.5 R10I.2 | v13,19.68 13,19.5
  pour Route2 (rank 2): 25.87,-0.25 0,-0.25 0,42 7.17,42 7.17,34.42 19,34.42 19,39.5 25.5,39.5 25.5,42 26,42
VDD_USB  (via drill 0.15 pad 0.5)
  Top 0.508: SJ4.1 v22.21,33.02 | J01U.1 v14.6,34.46 v14.59,34.45
  Route15 0.457: v22.21,33.02 16.02,33.02 v14.59,34.45
  Bottom 0.457: v14.59,34.45 14.9,34.13 14.9,30.16 14.75,30.01 U01U.4
VDDA
  Top 0.203: 6.8,11.13 C14D.1
  Top 0.254: U10.9 6.8,11.13
  Top 0.457: L10A.2 C14D.1
VIN
  Top 0.203: U01R.3 U01R.4
  Top 0.254: SJ4.2
  Top 0.305: SJ4.2 23.32,32.54 23.79,32.08 U01R.4 24.43,31.76 C01R.1
VOUT  (via drill 0.15 pad 0.5)
  Top 0.254: v9.82,23.5 9.85,23.47 U01.4 9.85,21.32 C01O.1 | v8.55,30.16 R01C.1
  Top 0.305: R01C.1 7.63,30.16 R01F.1
  Bottom 0.254: v9.82,23.5 8.55,23.5 8.24,23.81 8.24,29.84 v8.55,30.16
VOUT_SET
  Top 0.254: R02V.1 9.96,28.39 9.82,28.26 9.82,27.98 U01.5
  Top 0.305: R02V.1 C01V.1
  Top 0.457: R01V.2 R02V.1
VSOL  (via drill 0.15 pad 0.5)
  Top 0.254: U10.11 9.85,10.13 v9.98,10
  Top 0.457: R01S.1 v2.68,20.16 R02S.2 C01S.1
  Route15 0.203: v9.98,10 9.35,10 2.68,16.67 v2.68,20.16
VSUN
  Top 0.508: R01S.2 1.12,25.27 1.89,26.04 3.11,26.04 J01S.1
  Bottom 0.457: SJ2.3 13.7,21.97 13.32,21.59 | 5.7,21.59 4.55,22.73 4.55,24.69 4.08,25.16 SJ1.1 3.21,26.04 J01S.1
  Bottom 0.508: 13.32,21.59 5.7,21.59
VX  (via drill 0.15 pad 0.5)
  Top 0.305: 9.4,30.19 10.14,30.19 R02F.1 | R01L.2 22.68,34.32 R02L.1
  Top 0.457: SJ4.3 v24.27,33.02 | C02O.1 R01C.2 9.37,30.16 9.4,30.19 | R02F.1 R01V.1 v11.1,30.8
  Top 0.508: SJ4.3 24.02,33.77 R01L.2
  Route15 0.203: v11.73,22.54 11.1,23.18 v11.1,30.8
  Route15 0.457: v11.1,30.8 21.57,30.8 23.8,33.02 v24.27,33.02
  Bottom 0.508: SJ2.1 v11.73,22.54

### Text on the board
Top: 1
Route2: 2
Route15: 3
Bottom: 4
tPlace: SOLAR COUNTER | 200412-v1.0 | SOLAR | BATTERY | SERIAL | DEBUG
bPlace: 0.3MM | 0.4MM | 0.5MM | 0.6MM | 0.7MM | 0.8MM | 0.9MM | 1.0MM | 0.05MM | 0.10MM | 0.15MM | 0.20MM | 0.25MM | DC/DC | DC/DC | SOLAR